# EAGLE schematic cansat_vehicle_v3_brd3 (EAGLE 7.1.0)
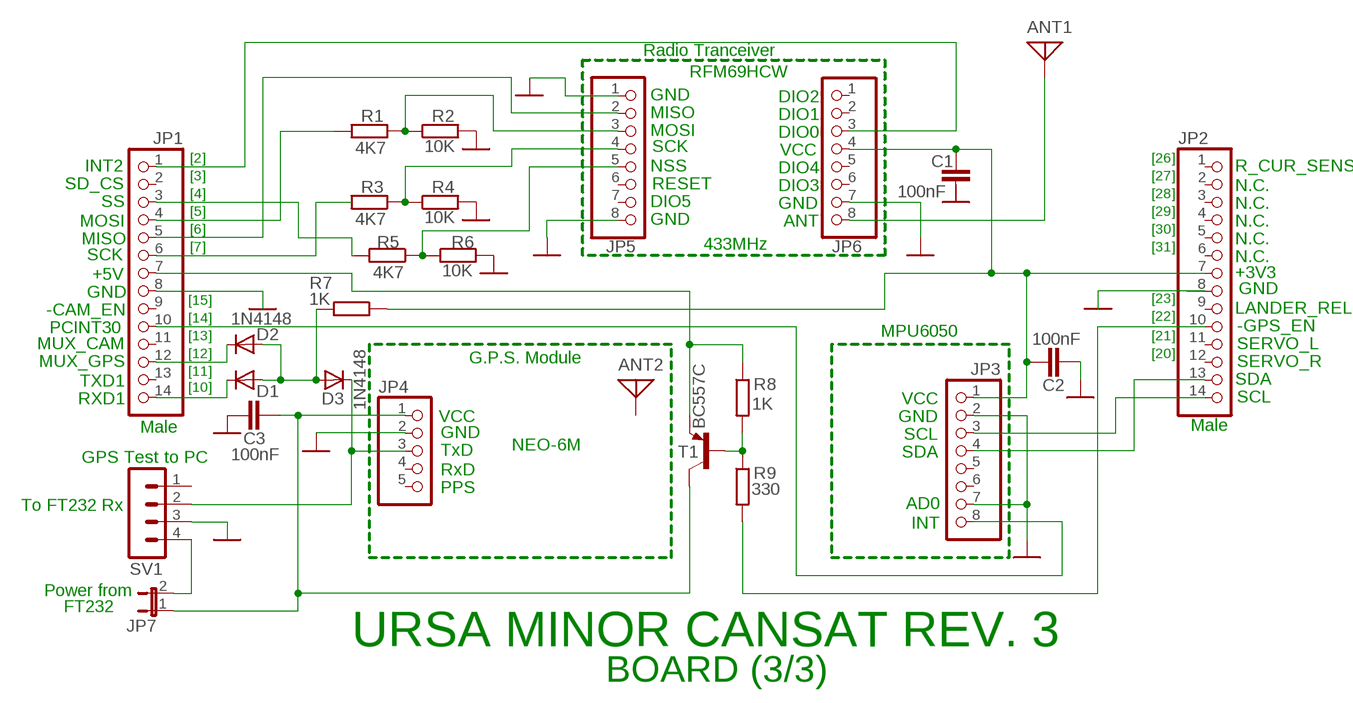
[diagram p0: schematic, sheet 1]

## Parts
ANT1  ANTENNA  [PAD-01]
ANT2  ANTENNA  [PAD-01]
C1  100nF  C2.5/2  [C2.5-2]
C2  100nF  C2.5/2  [C2.5-2]
C3  100nF  C2.5/2  [C2.5-2]
D1  1N4148DO35-10  [DO35-10]
D2  1N4148  1N4148DO35-10  [DO35-10]
D3  1N4148  1N4148DO35-10  [DO35-10]
JP1  PINHD-1X14  [1X14]
JP2  PINHD-1X14  [1X14]
JP3  PINHD-1X8  [1X08]
JP4  PINHD-1X5  [1X05]
JP5  PINHD-1X8  [1X08]
JP6  PINHD-1X8  [1X08]
JP7  JP1E  [JP1]
R1  4K7  R-EU_0204_2V  [0204V]
R2  10K  R-EU_0204_2V  [0204V]
R3  4K7  R-EU_0204_2V  [0204V]
R4  10K  R-EU_0204_2V  [0204V]
R5  4K7  R-EU_0204_2V  [0204V]
R6  10K  R-EU_0204_2V  [0204V]
R7  1K  R-EU_0204_2V  [0204V]
R8  1K  R-EU_0204_2V  [0204V]
R9  330  R-EU_0204_2V  [0204V]
SV1  MA04-1  [MA04-1]
T1  BC557C  -PNP-TO92  [TO92]

## Nets
GND: C2.2 C3.2 JP3.2 JP3.7 JP4.2 JP5.1 JP5.8 JP6.7 R2.2 R4.2 R6.2
N$1: D3.C JP4.3 SV1.2
N$2: SV1.3
N$3: JP7.2 SV1.4
N$4: C3.1 JP4.1 JP7.1 T1.3(C)
N$5: JP1.8
N$6: D1.C JP1.14
N$7: D2.C JP1.12
N$8: D1.A D2.A D3.A R7.2
N$10: JP1.7 R8.1 T1.1(E)
N$11: R8.2 R9.1 T1.2(B)
N$12: JP2.10 R9.2
N$15: ANT1.1 JP6.8
N$32: JP1.6 R3.2
N$33: JP1.3 R5.2
N$38: JP1.1 JP6.3
N$39: JP5.5 R5.1 R6.1
N$49: JP2.14 JP3.3
N$50: JP1.5 JP5.2
N$51: JP1.4 R1.2
N$52: JP5.4 R3.1 R4.1
N$53: JP5.3 R1.1 R2.1
N$54: JP2.13 JP3.4
N$55: JP2.8
N$56: JP1.10 JP3.8
VCC: C1.2 C2.1 JP2.7 JP3.1 JP6.4 R7.1
Unconnected: ANT2.1 C1.1 JP1.2 JP1.9 JP1.11 JP1.13 JP2.1 JP2.2 JP2.3 JP2.4 JP2.5 JP2.6 JP2.9 JP2.11 JP2.12 JP3.5 JP3.6 JP4.4 JP4.5 JP5.6 JP5.7 JP6.1 JP6.2 JP6.5 JP6.6 SV1.1

## Notes on the sheet
- Radio Tranceiver
- RFM69HCW
- GND | DIO2
- MISO | DIO1
- MOSI | DIO0
- SCK | VCC
- [2] | [26]
- INT2 | NSS | DIO4 | R_CUR_SENS
- SD_CS | [3] | [27]
- RESET | DIO3 | N.C.
- [4] | [28]
- SS | DIO5 | GND | N.C.
- [5] | [29]
- MOSI | GND | ANT | N.C.
- [6] | [30]
- MISO | N.C.
- [7] | 433MHz | [31]
- SCK | N.C.
- +5V | +3V3
- GND | GND
- [15] | [23]
- -CAM_EN | LANDER_REL
- [14] | [22]
- PCINT30 | -GPS_EN
- [13] | MPU6050 | [21]
- MUX_CAM | SERVO_L
- [12] | [20]
- MUX_GPS | G.P.S. Module | SERVO_R
- [11]
- TXD1 | SDA
- [10]
- RXD1 | VCC | SCL
- VCC | GND
- Male | Male
- GND | SCL
- NEO-6M
- TxD | SDA
- GPS Test to PC
- RxD
- PPS
- To FT232 Rx | AD0
- INT
- Power from
- FT232
- URSA MINOR CANSAT REV. 3
- BOARD (3/3)

## Library data of the parts
ANT1 ANT2 = discrete:ANTENNA: Antenna
C1-C3 = capacitor-wima:C: CAPACITOR naming: grid - package width
D1-D3 = diode:1N4148: DIODE high speed (Philips)
JP1 JP2 = pinhead:PINHD-1X14: PIN HEADER
JP3 JP5 JP6 = pinhead:PINHD-1X8: PIN HEADER
JP4 = pinhead:PINHD-1X5: PIN HEADER
JP7 = jumper:JP1E: JUMPER
R1-R9 = resistor:R-EU_: RESISTOR, European symbol; SPICEPREFIX: R
SV1 = con-lstb:MA04-1: PIN HEADER; OC_FARNELL: unknown; OC_NEWARK: unknown
T1 = transistor:*-PNP-: PNP Transistror